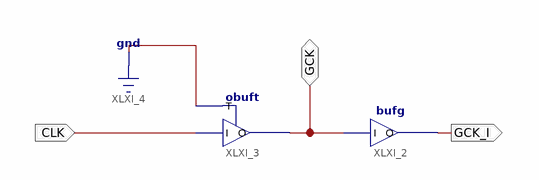
[diagram p0: schematic sheet 1]
// Xilinx ISE schematic weird.sch (xbr) as structural Verilog: 2 symbols, 3 ports
module weird (
  input  CLK,
  inout  GCK,
  output GCK_I
);

  bufg XLXI_2 (.I(GCK), .O(GCK_I));
  obuft XLXI_3 (.I(CLK), .T(1'b0), .O(GCK));
endmodule
